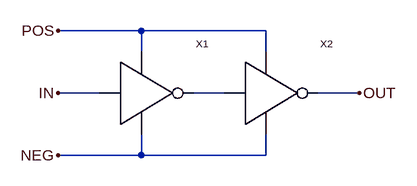
[diagram p0: schematic buffer.asc]
buffer.asc, the LTspice schematic file:
Version 4
SHEET 1 880 680
WIRE 144 64 16 64
WIRE 336 64 144 64
WIRE 144 96 144 64
WIRE 336 96 336 64
WIRE 80 160 16 160
WIRE 272 160 224 160
WIRE 480 160 416 160
WIRE 144 256 144 224
WIRE 144 256 16 256
WIRE 336 256 336 224
WIRE 336 256 144 256
FLAG 16 64 POS
FLAG 16 160 IN
FLAG 16 256 NEG
FLAG 480 160 OUT
SYMBOL inverter 144 160 R0
SYMATTR InstName X1
SYMBOL inverter 336 160 R0
SYMATTR InstName X2

The netlist it stands for:
* buffer.asc
XX1 IN N001 POS NEG inverter  ; pins Vin Vout Vpos Vneg
XX2 N001 OUT POS NEG inverter  ; pins Vin Vout Vpos Vneg
.backanno
.end